# Altium schematic sheet battery_module.SchDoc
size A4
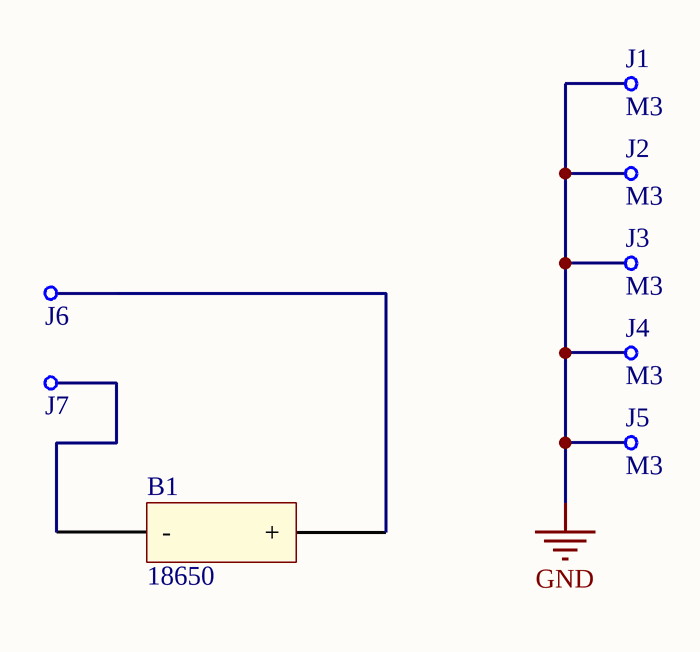
[diagram p0: battery_module.SchDoc]

## Parts
B1  18650  [18650]
J1  M3  [HOLE_M3]
J2  M3  [HOLE_M3]
J3  M3  [HOLE_M3]
J4  M3  [HOLE_M3]
J5  M3  [HOLE_M3]
J6  Pad  [Hole 1.6mm]  (value not drawn)
J7  Pad  [Hole 1.6mm]  (value not drawn)

## Nets
GND: J1.1 J2.1 J3.1 J4.1 J5.1
NetB1_1: B1.1(+) J6.1
NetB1_2: B1.2(-) J7.1

## Library data of the parts
B1 = 18650: Symbol: KEYSTONE 54; URL: https://www.tme.eu/pl/details/keys54/baterie-pojemniki-i-uchwyty/keystone/54/; Supplier: TME
J1-J5 = Screw M3 Hole: Power Element with threaded hole M3